# EAGLE schematic print Buddy schematic v5 (EAGLE 9.7.0)
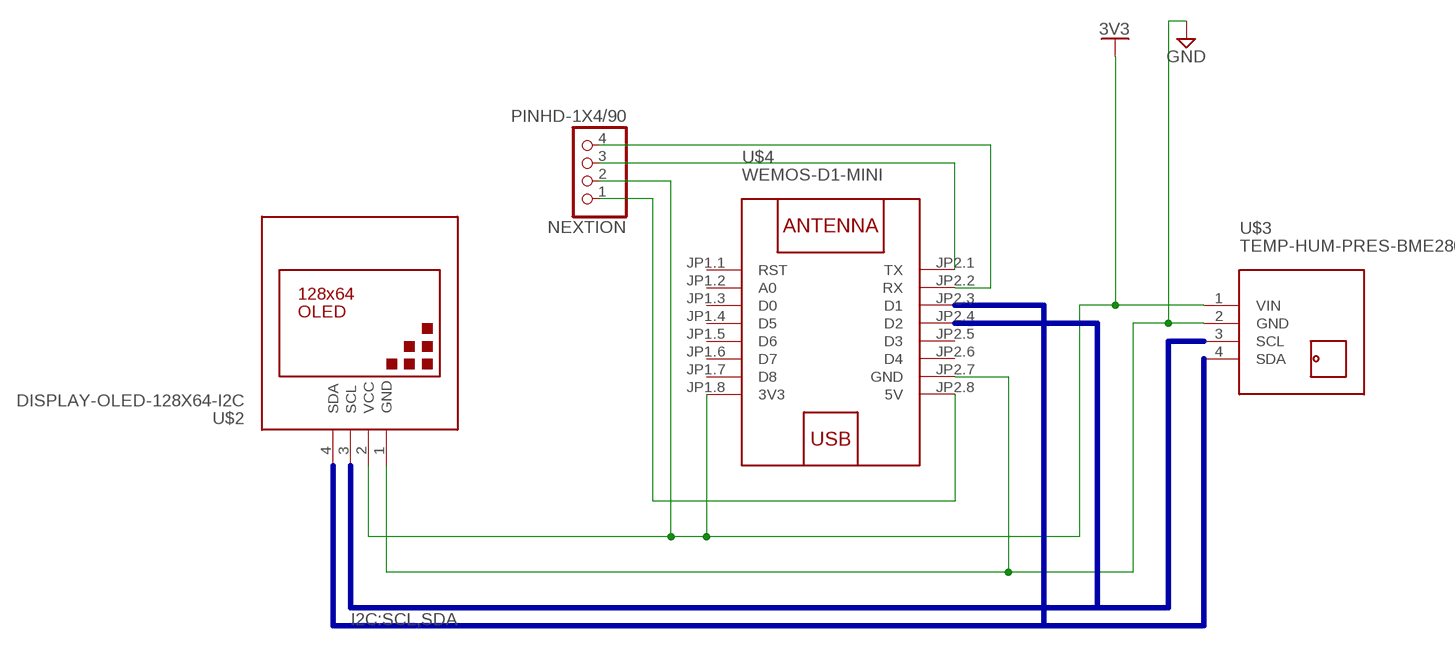
[diagram p0: schematic, sheet 1]

## Parts
NEXTION  PINHD-1X4/90  [1X04/90]
U$2  DISPLAY-OLED-128X64-I2C  [DISPLAY-OLED-128X64-I2C]
U$3  TEMP-HUM-PRES-BME280  [TEMP-HUM-PRES-BME280]
U$4  WEMOS-D1-MINI  [WEMOS-D1-MINI]

## Nets
3V3: NEXTION.2 U$2.2(VCC) U$3.1(VIN) U$4.JP1.8(3V3)
GND: U$2.1(GND) U$3.2(GND) U$4.JP2.7(GND)
N$3: NEXTION.1 U$4.JP2.8(5V)
N$4: NEXTION.4 U$4.JP2.2(RX)
N$5: NEXTION.3 U$4.JP2.1(TX)
Unconnected: U$2.3(SCL) U$2.4(SDA) U$3.3(SCL) U$3.4(SDA) U$4.JP1.1(RST) U$4.JP1.2(A0) U$4.JP1.3(D0) U$4.JP1.4(D5) U$4.JP1.5(D6) U$4.JP1.6(D7) U$4.JP1.7(D8) U$4.JP2.3(D1) U$4.JP2.4(D2) U$4.JP2.5(D3) U$4.JP2.6(D4)

## Buses
B$1
I2C:SCL,SDA

## Library data of the parts
NEXTION = Connector:PINHD-1X4: PIN HEADER; CATEGORY: CONNECTOR; SUB-CATEGORY: PIN-HEADER
U$2 = diy-modules:DISPLAY-OLED-128X64-I2C: 128x64 Dot Matrix OLED Module based on SSD1306 chip Variant with I2C interface More details available here: http://www.instructables.com/id/Monochrome-096-i2c-OLED-display-with-arduino-SSD13/ SSD1306 datasheet: https://cdn-shop.adafruit.com/datasheets/SSD1306.pdf Click here to find device on ebay.com <http://www.ebay.com/sch/oled+display+128x64+iic> Note: There are two variants: I2C and SPI. Search for the proper version.
U$3 = diy-modules:TEMP-HUM-PRES-BME280: Digital Humidity-Temperature-Pressure Sensor based on BME280 device More information about BME280 device is available here: https://www.bosch-sensortec.com/bst/products/all_products/bme280 Click here to find device on ebay.com <http://www.ebay.com/sch/bme280+breakout>
U$4 = diy-modules:WEMOS-D1-MINI: WEMOS D1 mini: Mini Wi-Fi Board based on ESP-8266 device More details can be found here: https://www.wemos.cc/product/d1-mini.html Click here to find device on ebay.com <http://www.ebay.com/sch/wemos+d1+mini+nodemcu>